# EAGLE schematic MCU Design (EAGLE 7.1.0)
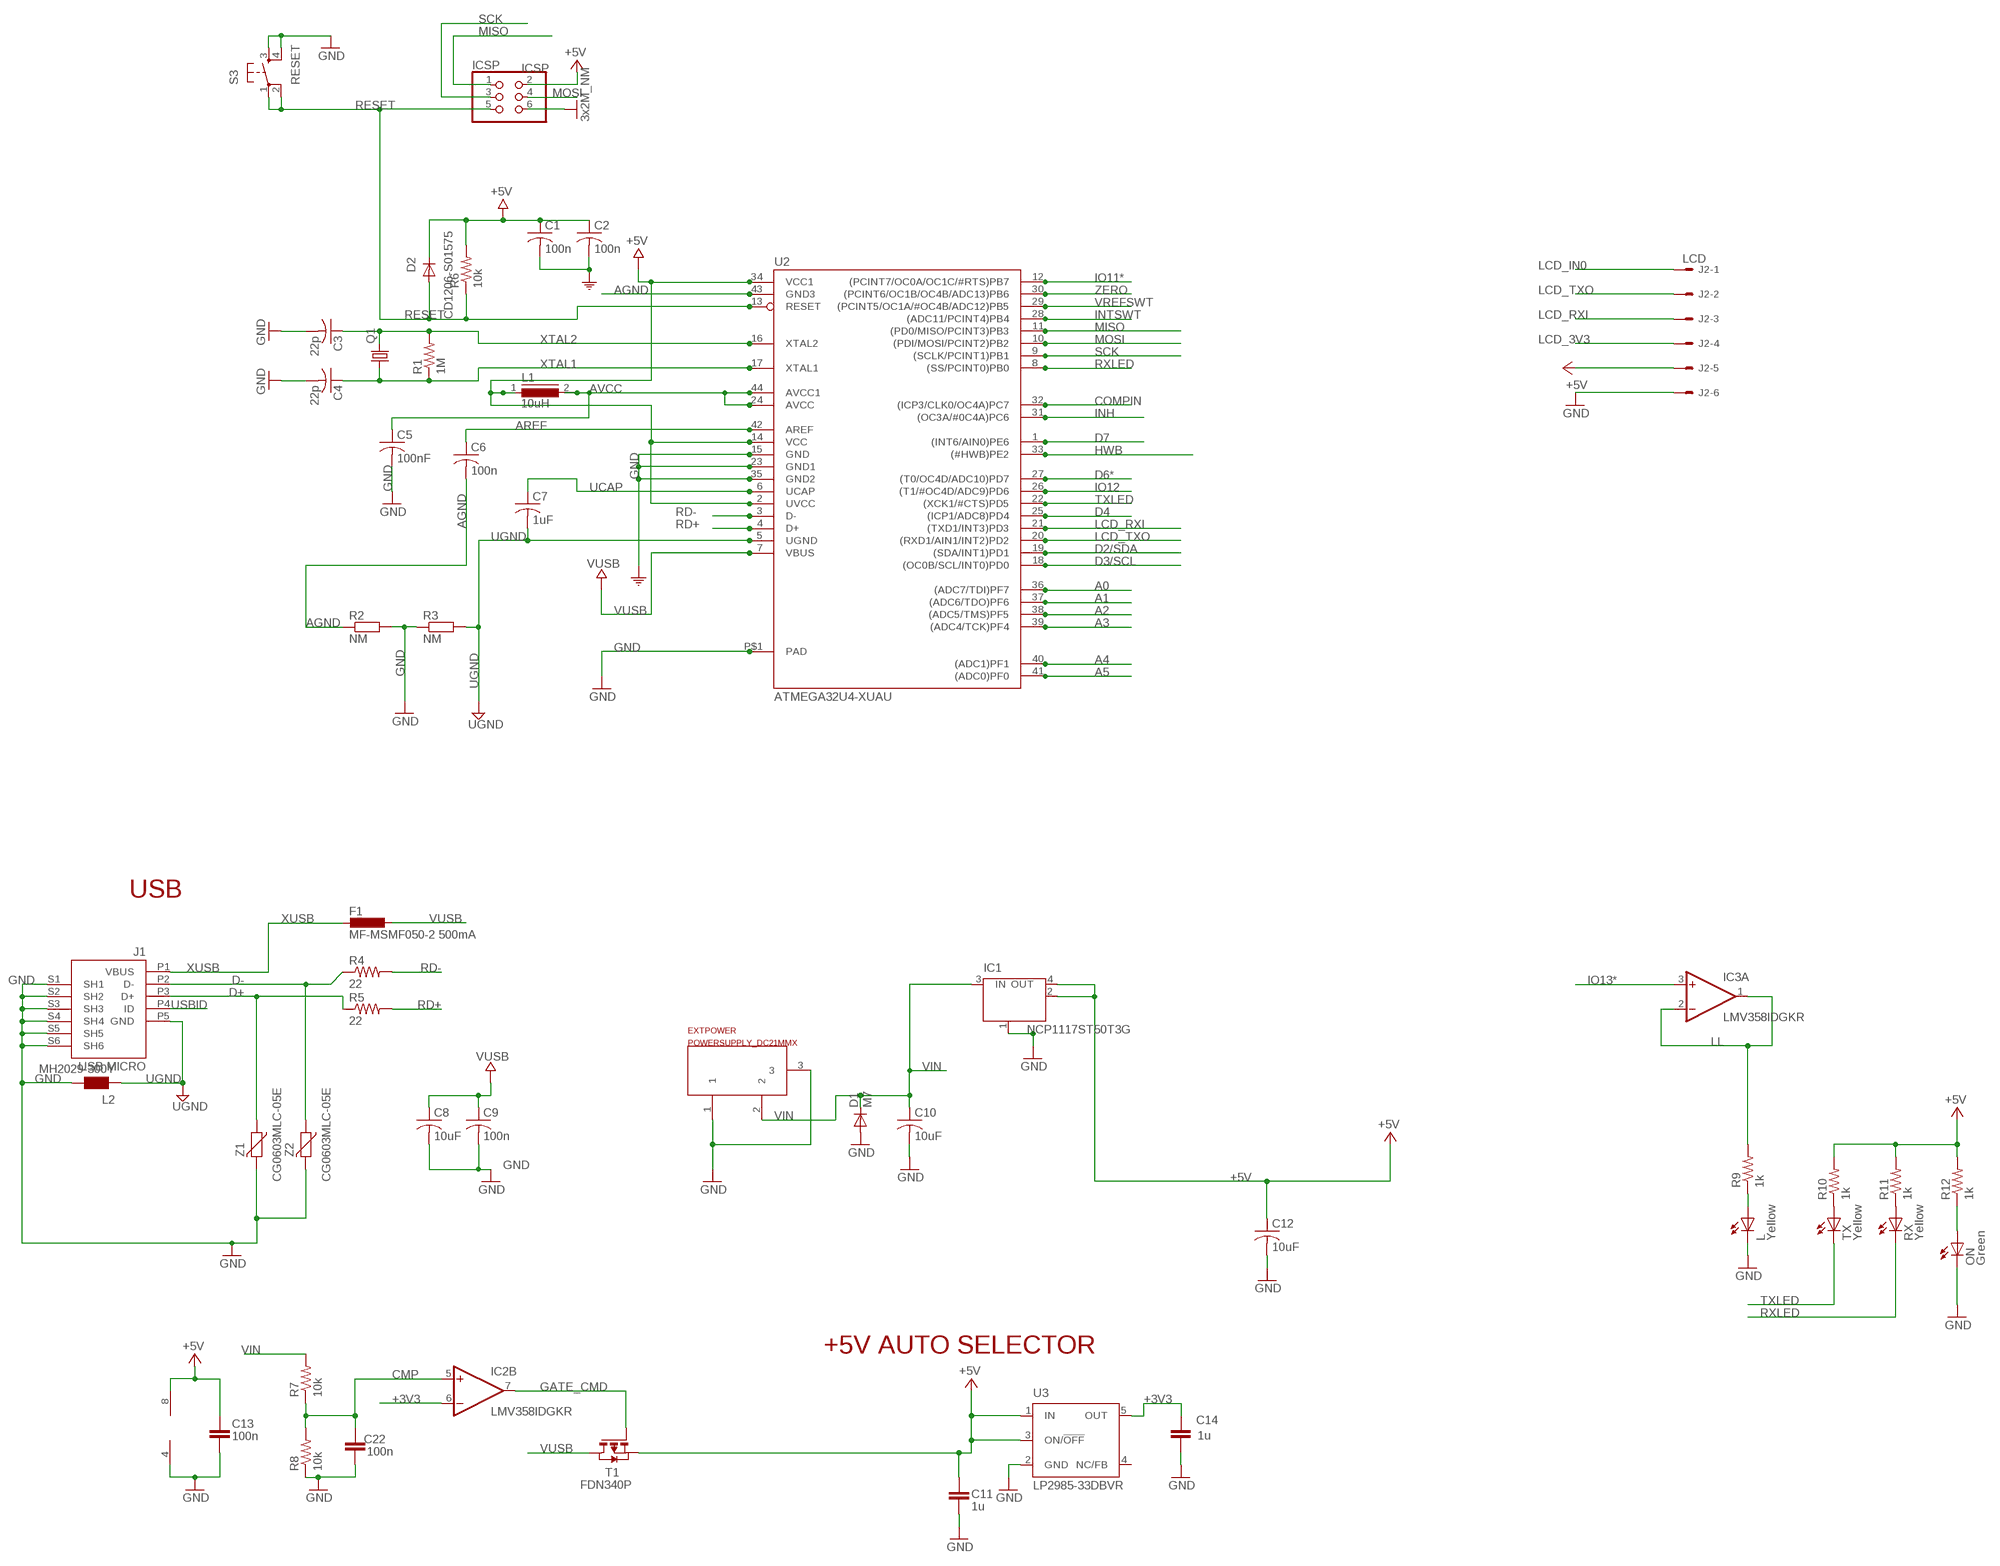
[diagram p0: schematic, sheet 1]

## Parts
C1  100n  C-USC0805  [C0805]
C2  100n  C-USC0805  [C0805]
C3  22p  C-USC0805  [C0805]
C4  22p  C-USC0805  [C0805]
C5  100nF  C-USC0805  [C0805]
C6  100n  C-USC0805  [C0805]
C7  1uF  C-USC0805  [C0805]
C8  10uF  C-USC0805  [C0805]
C9  100n  C-USC0805  [C0805]
C10  10uF  C-USC0805  [C0805]
C11  1u  C-EUC0603  [C0603-ROUND]
C12  10uF  C-USC0805  [C0805]
C13  100n  C-EUC0603  [C0603-ROUND]
C14  1u  C-EUC0603  [C0603-ROUND]
C22  100n  C-EUC0603  [C0603-ROUND]
D1  M7  DIODE-SMB  [SMB]
D2  CD1206-S01575  DIODE-MINIMELF  [MINIMELF]
EXTPOWER  POWERSUPPLY_DC21MMX  [POWERSUPPLY_DC-21MM]
F1  MF-MSMF050-2 500mA  L-EUL1812  [L1812]
IC1  NCP1117ST50T3G  MC33269ST-3.3T3  [SOT223]
IC2  LMV358IDGKR  LMV358MMX  [MSOP08]
IC3  LMV358IDGKR  LMV358MMX  [MSOP08]
ICSP  ICSP  PINHD-2X3  [2X03]
J1  USB MICRO  MYCON2_USB-MINI-B  [CON2_USB_MICRO_B_AT]
J2  LCD  22-05-7068-06  [7395-06]
L  Yellow  LEDCHIPLED_0805  [CHIPLED_0805]
L1  10uH  LBC15A  [LBC15A]
L2  MH2029-300Y  WE-CBF_0805  [0805]
ON  Green  LEDCHIPLED_0805  [CHIPLED_0805]
Q1  CRYSTALHC49UP  [HC49UP]
R1  1M  R-US_R0805  [R0805]
R2  NM  R-EU_R0402  [R0402]
R3  NM  R-EU_R0402  [R0402]
R4  22  R-US_R0805  [R0805]
R5  22  R-US_R0805  [R0805]
R6  10k  R-US_R0805  [R0805]
R7  10k  R-US_R0805  [R0805]
R8  10k  R-US_R0805  [R0805]
R9  1k  R-US_R0805  [R0805]
R10  1k  R-US_R0805  [R0805]
R11  1k  R-US_R0805  [R0805]
R12  1k  R-US_R0805  [R0805]
RX  Yellow  LEDCHIPLED_0805  [CHIPLED_0805]
S3  RESET  TAC_SWITCHSMD  [TACTILE_SWITCH_SMD]
T1  FDN340P  PMOSSOT23  [SOT-23]
TX  Yellow  LEDCHIPLED_0805  [CHIPLED_0805]
U2  ATMEGA32U4-XUAU  [TQFP44-PAD]
U3  LP2985-33DBVR  LP2985-XXDBVR33  [SOT23-DBV]
Z1  CG0603MLC-05E  VARISTORCN0603  [CT/CN0603]
Z2  CG0603MLC-05E  VARISTORCN0603  [CT/CN0603]

## Nets
+3V3: C14.2 IC2.6(B:-IN) U3.5(OUT)
+5V [usbvcc]: C1.1 C2.1 C11.2 C12.1 C13.1 D2.C IC1.2(OUT) IC1.4(OUT) IC2.8(P:V+) ICSP.2 J2.5 L1.1 R6.2 R10.2 R11.2 R12.2 T1.2(S) U2.2(UVCC) U2.14(VCC) U2.34(VCC1) U3.1(IN) U3.3(ON/!OFF)
A0: U2.36((ADC7/TDI)PF7)
A1: U2.37((ADC6/TDO)PF6)
A2: U2.38((ADC5/TMS)PF5)
A3: U2.39((ADC4/TCK)PF4)
A4: U2.40((ADC1)PF1)
A5: U2.41((ADC0)PF0)
AGND: C6.2 R2.1 U2.43(GND3)
AREF [aref]: C6.1 U2.42(AREF)
AVCC: C5.1 L1.2 U2.24(AVCC) U2.44(AVCC1)
CMP: C22.2 IC2.5(B:+IN) R7.1 R8.2
COMPIN: U2.32((ICP3/CLK0/OC4A)PC7)
D2/SDA: U2.19((SDA/INT1)PD1)
D3/SCL: U2.18((OC0B/SCL/INT0)PD0)
D4: U2.25((ICP1/ADC8)PD4)
D6*: U2.27((T0/OC4D/ADC10)PD7)
D7: U2.1((INT6/AIN0)PE6)
D+: J1.P3(D+) R5.1 Z1.1
D-: J1.P2(D-) R4.1 Z2.1
GATE_CMD: IC2.7(B:OUT) T1.3(G)
GND [gnd]: C1.2 C2.2 C3.2 C4.2 C5.2 C8.2 C9.2 C10.2 C11.1 C12.2 C13.2 C14.1 C22.1 D1.A EXTPOWER.1 EXTPOWER.3 IC1.1(GND/ADJ) IC2.4(P:V-) ICSP.6 J1.S1(SH1) J1.S2(SH2) J1.S3(SH3) J1.S4(SH4) J1.S5(SH5) J1.S6(SH6) J2.6 L2.2 L.C ON.C R2.2 R3.1 R8.1 S3.3 S3.4 U2.15(GND) U2.23(GND1) U2.35(GND2) U2.P$1(PAD) U3.2(GND) Z1.2 Z2.2 ; supply symbol labelled 3x2M_NM, COM
HWB: U2.33((#HWB)PE2)
INH: U2.31((OC3A/#0C4A)PC6)
INTSWT: U2.28((ADC11/PCINT4)PB4)
IO11*: U2.12((PCINT7/OC0A/OC1C/#RTS)PB7)
IO12: U2.26((T1/#OC4D/ADC9)PD6)
IO13*: IC3.3(A:+IN)
LCD_3V3: J2.4
LCD_IN0: J2.1
LCD_RXI: J2.3 U2.21((TXD1/INT3)PD3)
LCD_TXO: J2.2 U2.20((RXD1/AIN1/INT2)PD2)
LL: IC3.1(A:OUT) IC3.2(A:-IN) R9.2
MISO: ICSP.1 U2.11((PD0/MISO/PCINT3)PB3)
MOSI: ICSP.4 U2.10((PDI/MOSI/PCINT2)PB2)
N$1: R10.1 TX.A
N$2: L.A R9.1
N$3: ON.A R12.1
N$4: R11.1 RX.A
RD+: R5.2 U2.4(D+)
RD-: R4.2 U2.3(D-)
RESET: D2.A ICSP.5 R6.1 S3.1 S3.2 U2.13(RESET)
RXLED: RX.C U2.8((SS/PCINT0)PB0)
SCK: ICSP.3 U2.9((SCLK/PCINT1)PB1)
TXLED: TX.C U2.22((XCK1/#CTS)PD5)
UCAP: C7.1 U2.6(UCAP)
UGND [gnd]: C7.2 J1.P5(GND) L2.1 R3.2 U2.5(UGND)
USBID: J1.P4(ID)
VIN [power]: C10.1 D1.C EXTPOWER.2 IC1.3(IN) R7.2
VREFSWT: U2.29((PCINT5/OC1A/#OC4B/ADC12)PB5)
VUSB: C8.1 C9.1 F1.1 T1.1(D) U2.7(VBUS)
XTAL1: C4.1 Q1.1 R1.1 U2.17(XTAL1)
XTAL2: C3.1 Q1.2 R1.2 U2.16(XTAL2)
XUSB [usbvcc]: F1.2 J1.P1(VBUS)
ZERO: U2.30((PCINT6/OC1B/OC4B/ADC13)PB6)
Unconnected: IC2.1(A:OUT) IC2.2(A:-IN) IC2.3(A:+IN) IC3.5(B:+IN) IC3.6(B:-IN) IC3.7(B:OUT) U3.4(NC/FB)

## Notes on the sheet
- USB
- +5V AUTO SELECTOR

## Power pins joined to a net without a drawn wire
V+: IC3.8(P:V+)
V-: IC3.4(P:V-)

## Library data of the parts
C1-C10 C12 = resistor:C-US: CAPACITOR, American symbol
C11 C13 C14 C22 = SmartPrj:C-EU: CAPACITOR, European symbol
D1 D2 = diode:DIODE-: DIODE
EXTPOWER = SmartPrj:POWERSUPPLY_DC21MM
F1 = rcl:L-EU: INDUCTOR, European symbol
IC1 = linear:MC33269ST*: Adjustable Output Low Dropout Voltage Regulator 800 mA Source: http://www.onsemi.com/pub/Collateral/MC33269-D.PDF
IC2 IC3 = linear:LMV358?*: Dual General Purpose, Low Voltage, Rail-to-Rail Output Operational Amplifiers Source: http://www.national.com/mpf/LM/LMV321.html http://www.national.com/dt/lmv_qual.pdf
ICSP = SmartPrj:PINHD-2X3: PIN HEADER
J1 = SmartPrj:MYCON2_USB-MINI-B
J2 = con-molex:22-?-06: CONNECTOR wire to board 2.54 mm (.1 inch) pitch header; OC_FARNELL: unknown; OC_NEWARK: unknown
L ON RX TX = led:LED: LED OSRAM: - CHIPLED LG R971, LG N971, LY N971, LG Q971, LY Q971, LO R971, LY R971 LH N974, LH R974 LS Q976, LO Q976, LY Q976 LO Q996 - Hyper CHIPLED LW Q18S LB Q993, LB Q99A, LB R99A - SideLED LS A670, LO A670, LY A670, LG A670, LP A670 LB A673, LV A673, LT A673, LW A673 LH A674 LY A675 LS A676, LA A676, LO A676, LY A676, LW A676 LS A679, LY A679, LG A679 - Hyper Micro SIDELED® LS Y876, LA Y876, LO Y876, LY Y876 LT Y87S - SmartLED LW L88C, LW L88S LB L89C, LB L89S, LG L890 LS L89K, LO L89K, LY L89K LS L896, LA L896, LO L896, LY L896 - TOPLED LS T670, LO T670, LY T670, LG T670, LP T670 LSG T670, LSP T670, LSY T670, LOP T670, LYG T670 LG T671, LOG T671, LSG T671 LB T673, LV T673, LT T673, LW T673 LH T674 LS T676, LA T676, LO T676, LY T676, LB T676, LH T676, LSB T676, LW T676 LB T67C, LV T67C, LT T67C, LS T67K, LO T67K, LY T67K, LW E67C LS E67B, LA E67B, LO E67B, LY E67B, LB E67C, LV E67C, LT E67C LW T67C LS T679, LY T679, LG T679 LS T770, LO T770, LY T770, LG T770, LP T770 LB T773, LV T773, LT T773, LW T773 LH T774 LS E675, LA E675, LY E675, LS T675 LS T776, LA T776, LO T776, LY T776, LB T776 LHGB T686 LT T68C, LB T68C - Hyper Mini TOPLED® LB M676 - Mini TOPLED Santana® LG M470 LS M47K, LO M47K, LY M47K Source: http://www.osram.convergy.de LUXEON: - LUMILED® LXK2-PW12-R00, LXK2-PW12-S00, LXK2-PW14-U00, LXK2-PW14-V00 LXK2-PM12-R00, LXK2-PM12-S00, LXK2-PM14-U00 LXK2-PE12-Q00, LXK2-PE12-R00, LXK2-PE12-S00, LXK2-PE14-T00, LXK2-PE14-U00 LXK2-PB12-K00, LXK2-PB12-L00, LXK2-PB12-M00, LXK2-PB14-N00, LXK2-PB14-P00, LXK2-PB14-Q00 LXK2-PR12-L00, LXK2-PR12-M00, LXK2-PR14-Q00, LXK2-PR14-R00 LXK2-PD12-Q00, LXK2-PD12-R00, LXK2-PD12-S00 LXK2-PH12-R00, LXK2-PH12-S00 LXK2-PL12-P00, LXK2-PL12-Q00, LXK2-PL12-R00 Source: www.luxeon.com KINGBRIGHT: KA-3528ASYC Source: www.kingbright.com
L1 = inductors:LBC15A: INDUCTOR
L2 = wuerth-elektronik:WE-CBF: SMD EMI Suppression Ferrite Beads - excellent anti-EMI properties - low DCR - impedances till 3000 ohms - rated current up to 6 A
Q1 = crystal:CRYSTAL: CRYSTAL; OC_FARNELL: unknown; OC_NEWARK: unknown
R1 R4-R12 = resistor:R-US_: RESISTOR, American symbol
R2 R3 = SmartPrj:R-EU_: RESISTOR, European symbol
S3 = SparkFun:TAC_SWITCH: Momentary Switch Button commonly used for reset or general input. Spark Fun Electronics SKU : COM-00097
T1 = zetex:PMOSSOT23: MOS FET
U2 = SmartPrj:ATMEGA32U4-XU
U3 = SmartPrj:LP2985-XXDBVR: ULTRALOW-POWER 50-mA LOW-DROPOUT LINEAR REGULATORS 50-mA Low-Dropout Regulator Source: http://focus.ti.com/lit/ds/symlink/tps77001.pdf
Z1 Z2 = varistor:VARISTOR: VARISTOR

## Net classes
0 default: width 0.254 mm, drill 0.61 mm, clearance 0.254 mm
1 power: width 0.254 mm, drill 0.61 mm, clearance 0.254 mm
2 gnd: width 0.254 mm, drill 0.61 mm, clearance 0.254 mm
3 usbvcc: width 0.254 mm, drill 0.61 mm, clearance 0.254 mm
4 aref: width 0.254 mm, drill 0.61 mm, clearance 0.254 mm